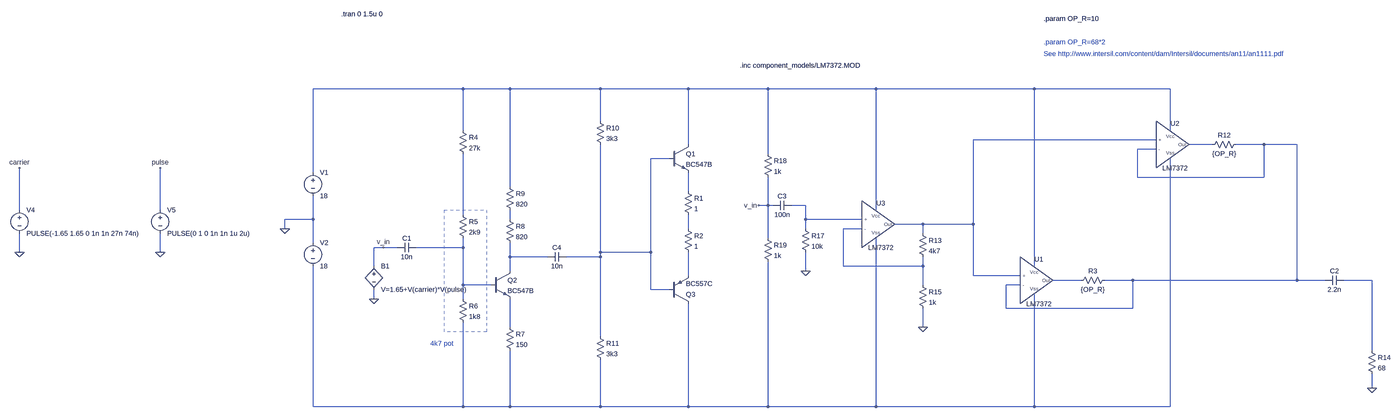
[diagram p0: schematic test_harness_output.asc, whole sheet]
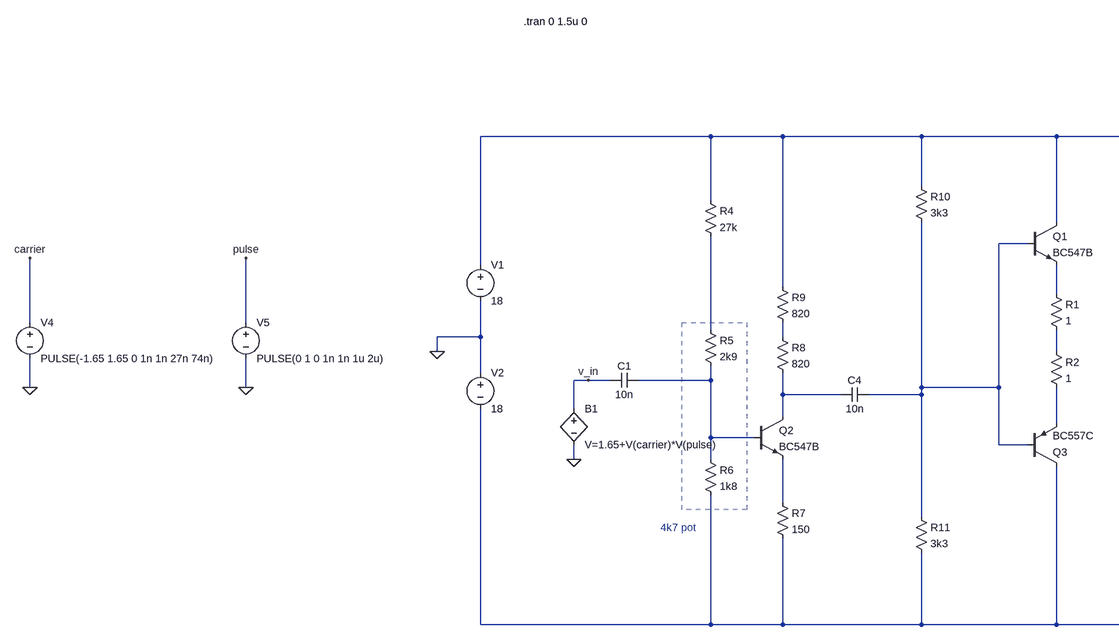
[diagram p1: schematic test_harness_output.asc, part, row 1 of 1, column 1 of 2]
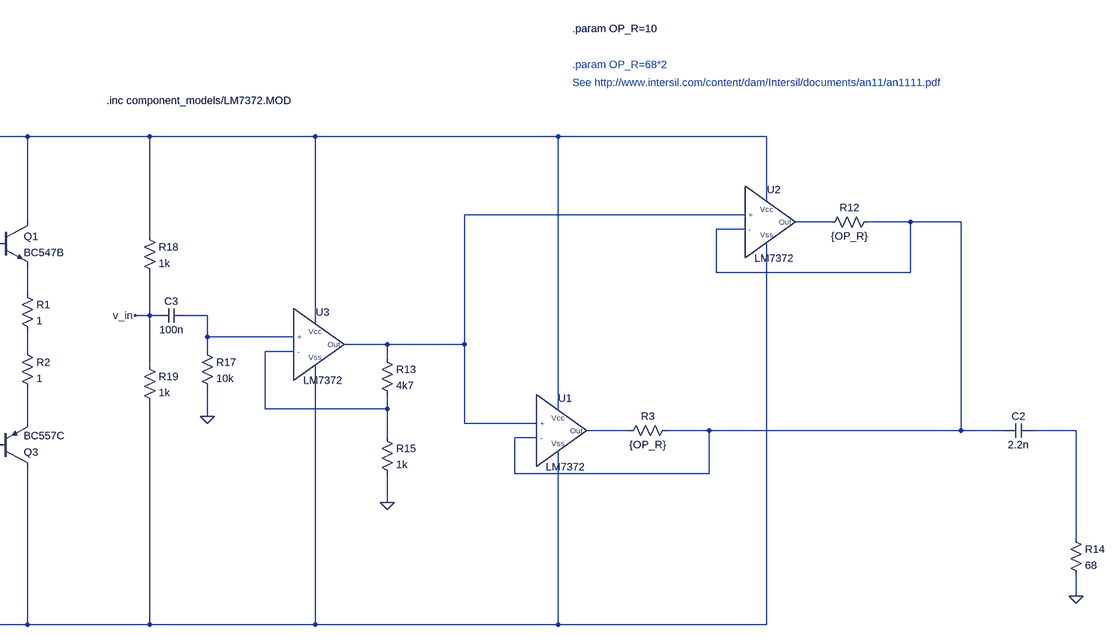
[diagram p2: schematic test_harness_output.asc, part, row 1 of 1, column 2 of 2]
test_harness_output.asc, the LTspice schematic file:
Version 4
SHEET 1 3812 824
WIRE -688 -272 -1200 -272
WIRE -528 -272 -688 -272
WIRE 32 -272 -528 -272
WIRE 752 -272 32 -272
WIRE 1024 -272 752 -272
WIRE 1392 -272 1024 -272
WIRE 2080 -272 1392 -272
WIRE 2544 -272 2080 -272
WIRE 32 -160 32 -272
WIRE -688 -128 -688 -272
WIRE 2544 -128 2544 -272
WIRE 2496 -96 1792 -96
WIRE 752 -80 752 -272
WIRE 2688 -80 2608 -80
WIRE 2864 -80 2768 -80
WIRE 2976 -80 2864 -80
WIRE 2496 -64 2432 -64
WIRE 1024 -48 1024 -272
WIRE 688 -32 624 -32
WIRE -1200 16 -1200 -272
WIRE 2432 32 2432 -64
WIRE 2864 32 2864 -80
WIRE 2864 32 2432 32
WIRE -528 64 -528 -272
WIRE 752 80 752 16
WIRE 1024 128 1024 32
WIRE 1024 128 992 128
WIRE 1040 128 1024 128
WIRE 1152 128 1104 128
WIRE -2256 144 -2256 0
WIRE -1776 144 -1776 0
WIRE 1392 144 1392 -272
WIRE -688 160 -688 -48
WIRE -1200 176 -1200 96
WIRE -1200 176 -1296 176
WIRE -528 176 -528 144
WIRE 1152 176 1152 128
WIRE 1344 176 1152 176
WIRE 1552 192 1456 192
WIRE 1792 192 1792 -96
WIRE 1792 192 1552 192
WIRE -1296 208 -1296 176
WIRE 752 208 752 160
WIRE 1152 208 1152 176
WIRE 1344 208 1280 208
WIRE 1552 224 1552 192
WIRE 1024 240 1024 128
WIRE -1200 256 -1200 176
WIRE -960 272 -992 272
WIRE -912 272 -960 272
WIRE -688 272 -688 240
WIRE -688 272 -848 272
WIRE -2256 288 -2256 224
WIRE -1776 288 -1776 224
WIRE 32 288 32 -80
WIRE 624 288 624 -32
WIRE 624 288 32 288
WIRE -528 304 -528 256
WIRE -400 304 -528 304
WIRE 32 304 32 288
WIRE 32 304 -336 304
WIRE -992 336 -992 272
WIRE 1280 336 1280 208
WIRE 1552 336 1552 304
WIRE 1552 336 1280 336
WIRE 2080 336 2080 -272
WIRE -528 352 -528 304
WIRE 1152 352 1152 288
WIRE 752 368 752 288
WIRE 1792 368 1792 192
WIRE 2032 368 1792 368
WIRE 2240 384 2144 384
WIRE 2416 384 2320 384
WIRE 2976 384 2976 -80
WIRE 2976 384 2416 384
WIRE 3072 384 2976 384
WIRE 3232 384 3136 384
WIRE -688 400 -688 272
WIRE -592 400 -688 400
WIRE 1552 400 1552 336
WIRE 2032 400 1984 400
WIRE 624 416 624 288
WIRE 688 416 624 416
WIRE -992 448 -992 416
WIRE -688 448 -688 400
WIRE 1984 480 1984 400
WIRE 2416 480 2416 384
WIRE 2416 480 1984 480
WIRE -528 544 -528 448
WIRE 1552 544 1552 480
WIRE 32 576 32 304
WIRE 3232 624 3232 384
WIRE 3232 752 3232 704
WIRE -1200 816 -1200 336
WIRE -688 816 -688 528
WIRE -688 816 -1200 816
WIRE -528 816 -528 624
WIRE -528 816 -688 816
WIRE 32 816 32 656
WIRE 32 816 -528 816
WIRE 752 816 752 464
WIRE 752 816 32 816
WIRE 1024 816 1024 320
WIRE 1024 816 752 816
WIRE 1392 816 1392 240
WIRE 1392 816 1024 816
WIRE 2080 816 2080 432
WIRE 2080 816 1392 816
WIRE 2544 816 2544 -32
WIRE 2544 816 2080 816
FLAG -1296 208 0
FLAG -2256 288 0
FLAG -1776 288 0
FLAG -2256 0 carrier
FLAG -1776 0 pulse
FLAG -992 448 0
FLAG 3232 752 0
FLAG -960 272 v_in
FLAG 992 128 v_in
FLAG 1552 544 0
FLAG 1152 352 0
SYMBOL voltage -1200 0 R0
WINDOW 123 0 0 Left 2
WINDOW 39 0 0 Left 2
SYMATTR InstName V1
SYMATTR Value 18
SYMBOL voltage -1200 240 R0
WINDOW 123 0 0 Left 2
WINDOW 39 0 0 Left 2
SYMATTR InstName V2
SYMATTR Value 18
SYMBOL voltage -2256 128 R0
WINDOW 123 0 0 Left 2
WINDOW 39 0 0 Left 2
SYMATTR InstName V4
SYMATTR Value PULSE(-1.65 1.65 0 1n 1n 27n 74n)
SYMBOL voltage -1776 128 R0
WINDOW 123 0 0 Left 2
WINDOW 39 0 0 Left 2
SYMATTR InstName V5
SYMATTR Value PULSE(0 1 0 1n 1n 1u 2u)
SYMBOL bv -992 320 R0
SYMATTR InstName B1
SYMATTR Value V=1.65+V(carrier)*V(pulse)
SYMBOL npn -592 352 R0
SYMATTR InstName Q2
SYMATTR Value BC547B
SYMBOL cap -848 256 R90
WINDOW 0 0 32 VBottom 2
WINDOW 3 32 32 VTop 2
SYMATTR InstName C1
SYMATTR Value 10n
SYMBOL res -704 -144 R0
SYMATTR InstName R4
SYMATTR Value 27k
SYMBOL res -704 144 R0
SYMATTR InstName R5
SYMATTR Value 2k9
SYMBOL res -704 432 R0
SYMATTR InstName R6
SYMATTR Value 1k8
SYMBOL res -544 528 R0
SYMATTR InstName R7
SYMATTR Value 150
SYMBOL res -544 160 R0
SYMATTR InstName R8
SYMATTR Value 820
SYMBOL res -544 48 R0
SYMATTR InstName R9
SYMATTR Value 820
SYMBOL cap -336 288 R90
WINDOW 0 0 32 VBottom 2
WINDOW 3 32 32 VTop 2
SYMATTR InstName C4
SYMATTR Value 10n
SYMBOL res 16 -176 R0
SYMATTR InstName R10
SYMATTR Value 3k3
SYMBOL res 16 560 R0
SYMATTR InstName R11
SYMATTR Value 3k3
SYMBOL npn 688 -80 R0
SYMATTR InstName Q1
SYMATTR Value BC547B
SYMBOL pnp 688 464 M180
SYMATTR InstName Q3
SYMATTR Value BC557C
SYMBOL res 736 64 R0
SYMATTR InstName R1
SYMATTR Value 1
SYMBOL res 736 192 R0
SYMATTR InstName R2
SYMATTR Value 1
SYMBOL LM7372 2096 384 R0
SYMATTR InstName U1
SYMBOL LM7372 2560 -80 R0
SYMATTR InstName U2
SYMBOL LM7372 1408 192 R0
SYMATTR InstName U3
SYMBOL res 3216 608 R0
SYMATTR InstName R14
SYMATTR Value 68
SYMBOL res 2336 368 R90
WINDOW 0 0 56 VBottom 2
WINDOW 3 32 56 VTop 2
SYMATTR InstName R3
SYMATTR Value {OP_R}
SYMBOL res 2784 -96 R90
WINDOW 0 0 56 VBottom 2
WINDOW 3 32 56 VTop 2
SYMATTR InstName R12
SYMATTR Value {OP_R}
SYMBOL cap 3136 368 R90
WINDOW 0 0 32 VBottom 2
WINDOW 3 32 32 VTop 2
SYMATTR InstName C2
SYMATTR Value 2.2n
SYMBOL res 1536 208 R0
SYMATTR InstName R13
SYMATTR Value 4k7
SYMBOL res 1536 384 R0
SYMATTR InstName R15
SYMATTR Value 1k
SYMBOL res 1136 192 R0
SYMATTR InstName R17
SYMATTR Value 10k
SYMBOL cap 1104 112 R90
WINDOW 0 0 32 VBottom 2
WINDOW 3 32 32 VTop 2
SYMATTR InstName C3
SYMATTR Value 100n
SYMBOL res 1008 -64 R0
SYMATTR InstName R18
SYMATTR Value 1k
SYMBOL res 1008 224 R0
SYMATTR InstName R19
SYMATTR Value 1k
TEXT -1104 -528 Left 2 !.tran 0 1.5u 0
TEXT -800 600 Left 2 ;4k7 pot
TEXT 928 -352 Left 2 !.inc component_models/LM7372.MOD
TEXT 2112 -432 Left 2 ;.param OP_R=68*2
TEXT 2112 -392 Left 2 ;See http://www.intersil.com/content/dam/Intersil/documents/an11/an1111.pdf
TEXT 2112 -512 Left 2 !.param OP_R=10
RECTANGLE Normal -608 560 -752 144 2

The netlist it stands for:
* test_harness_output.asc
V1 N001 0 18
V2 0 N018 18
V4 carrier 0 PULSE(-1.65 1.65 0 1n 1n 27n 74n)
V5 pulse 0 PULSE(0 1 0 1n 1n 1u 2u)
B1 v_in 0 V=1.65+V(carrier)*V(pulse)
Q2 N013 N012 N017 0 BC547B
C1 N012 v_in 10n
R4 N001 N008 27k
R5 N008 N012 2k9
R6 N012 N018 1k8
R7 N017 N018 150
R8 N009 N013 820
R9 N001 N009 820
C4 N005 N013 10n
R10 N001 N005 3k3
R11 N005 N018 3k3
Q1 N001 N005 N006 0 BC547B
Q3 N018 N005 N014 0 BC557C
R1 N006 N010 1
R2 N010 N014 1
XU1 N004 N002 N001 N018 N015 LM7372  ; pins - + Vcc Vss Out
XU2 N004 N002 N001 N018 N003 LM7372  ; pins - + Vcc Vss Out
XU3 N011 N007 N001 N018 N002 LM7372  ; pins - + Vcc Vss Out
R14 N016 0 68
R3 N004 N015 {OP_R}
R12 N004 N003 {OP_R}
C2 N016 N004 2.2n
R13 N002 N011 4k7
R15 N011 0 1k
R17 N007 0 10k
C3 N007 v_in 100n
R18 N001 v_in 1k
R19 v_in N018 1k
.model NPN NPN
.model PNP PNP
.lib standard.bjt
.tran 0 1.5u 0
* 4k7 pot
.inc component_models/LM7372.MOD
* .param OP_R=68*2
* See http://www.intersil.com/content/dam/Intersil/documents/an11/an1111.pdf
.param OP_R=10
.lib Z:\home\josh\to_spice\component_models\MCP661.inc
.backanno
.end